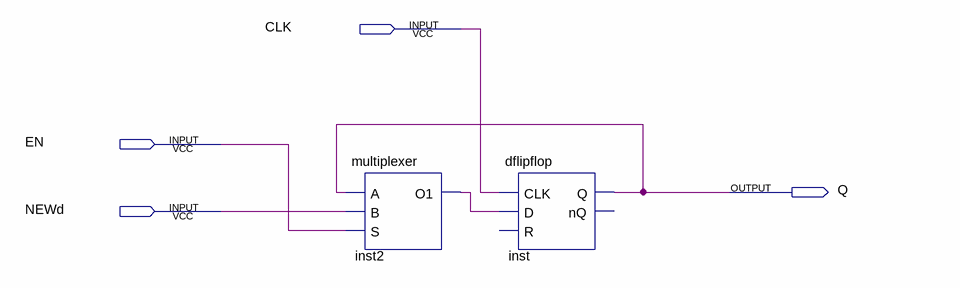
[diagram p0: schematic sheet]
// Quartus schematic enabledflipflop.bdf as structural Verilog: 2 symbols, 4 pins
module enabledflipflop (
  input  CLK,
  input  EN,
  input  NEWd,
  output Q
);

  wire inst2_o1;

  multiplexer inst2 (.A(Q), .B(NEWd), .S(EN), .O1(inst2_o1));
  dflipflop inst (.CLK(CLK), .D(inst2_o1), .Q(Q));  // open: R, nQ
endmodule
